# EAGLE design WasteInfoBoard_V_1_2 (EAGLE 7.7.0)
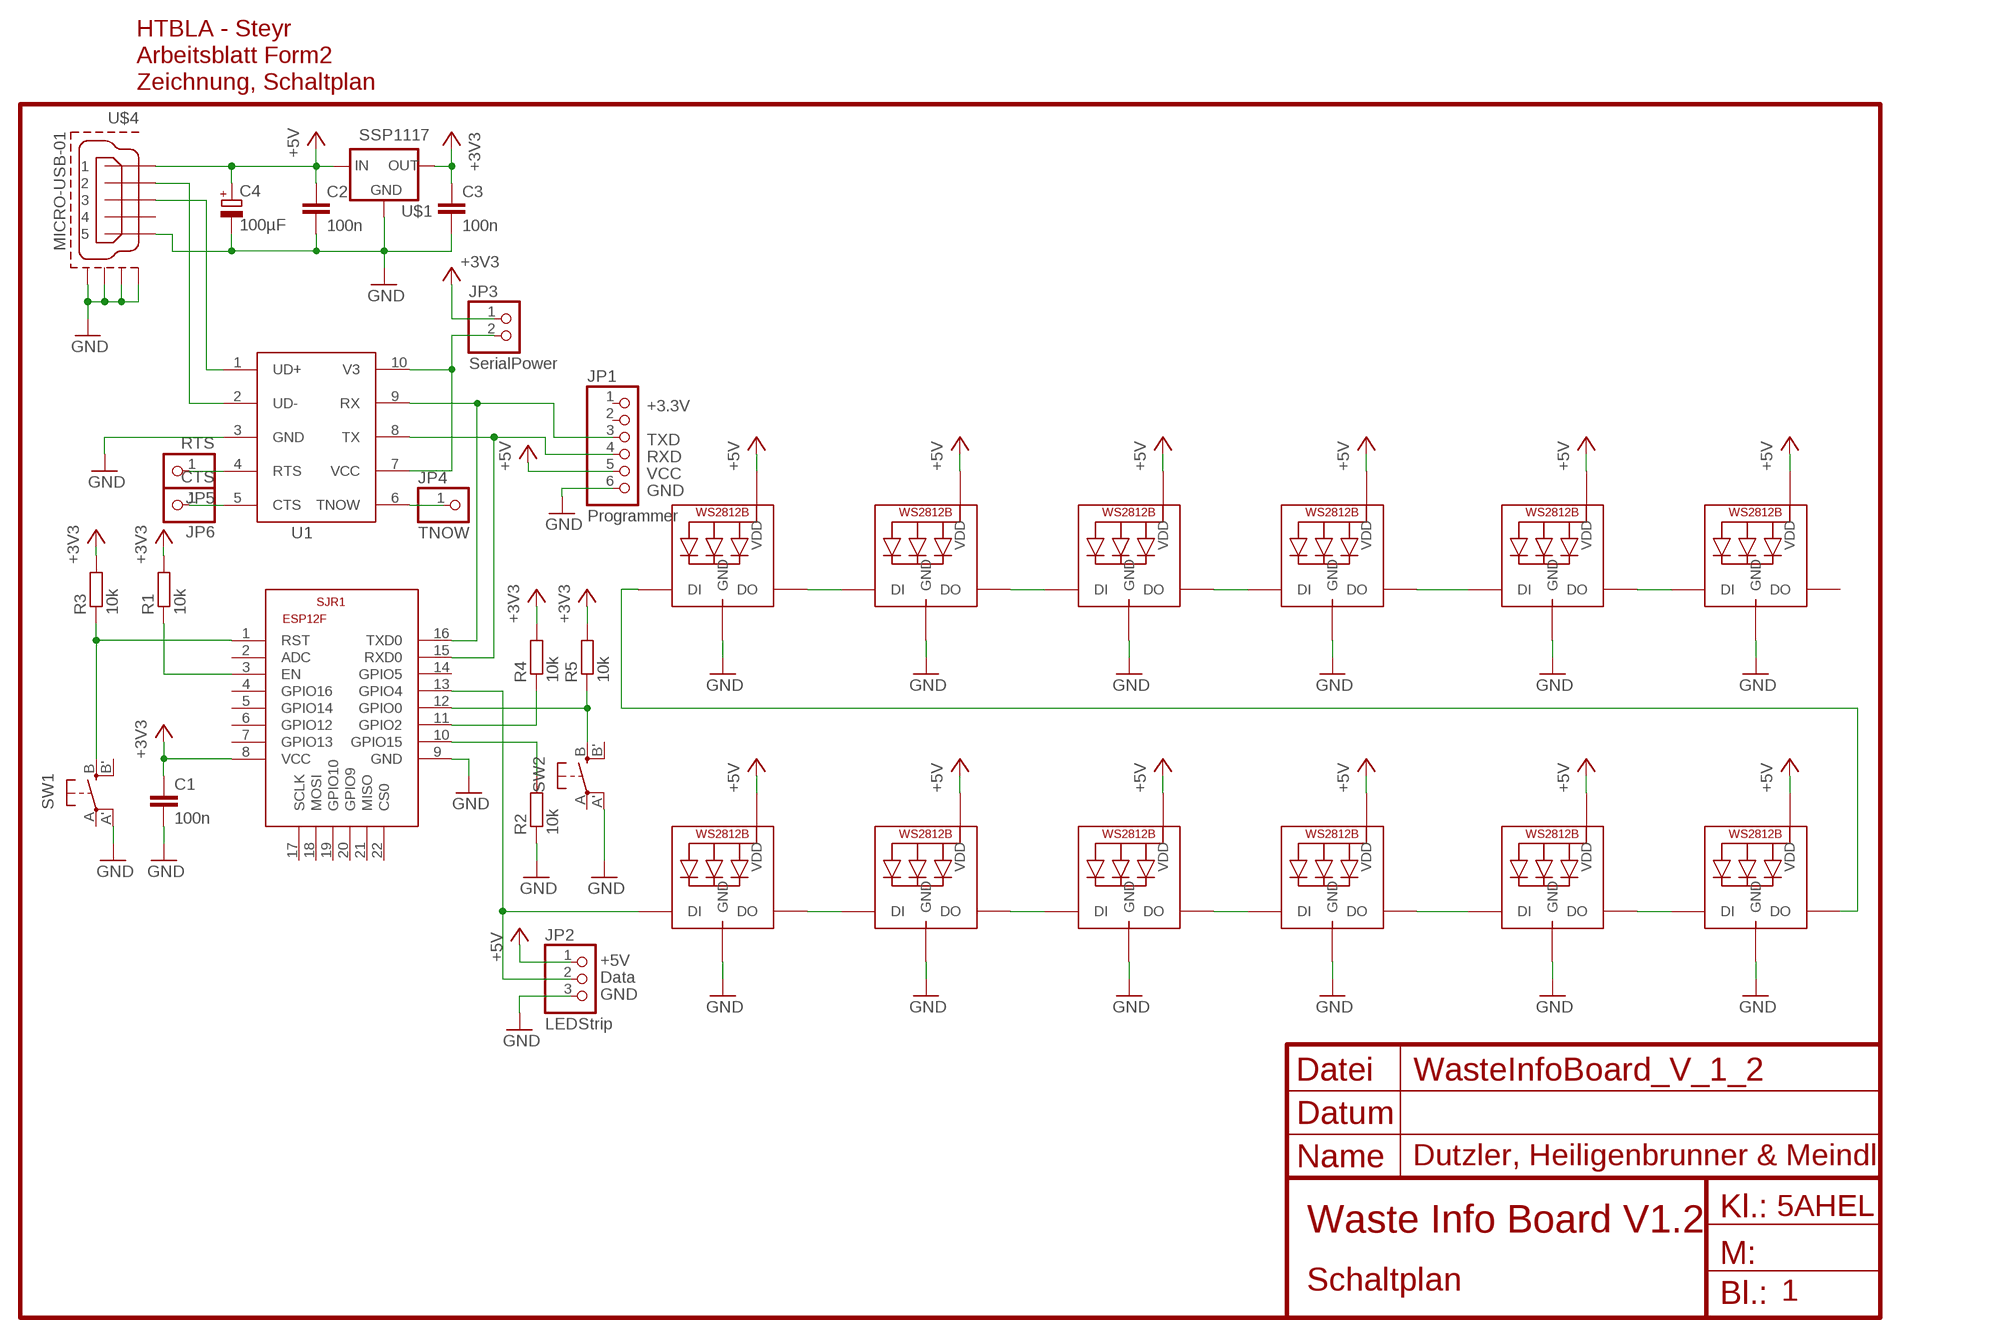
[diagram p0: schematic, sheet 1]

## Parts
C1  100n  C-EUC0805  [C0805]
C2  100n  C-EUC0805  [C0805]
C3  100n  C-EUC0805  [C0805]
C4  100µF  CPOL-EU175TMP-0808  [175TMP-0808]
JP1  Programmer  PINHD-1X6  [1X06]
JP2  LEDStrip  PINHD-1X3  [1X03]
JP3  SerialPower  PINHD-1X2  [1X02]
JP4  TNOW  PINHD-1X1  [1X01]
JP5  RTS  PINHD-1X1  [1X01]
JP6  CTS  PINHD-1X1  [1X01]
LED1  WS2812B5050  [WS2812B]
LED2  WS2812B5050  [WS2812B]
LED3  WS2812B5050  [WS2812B]
LED4  WS2812B5050  [WS2812B]
LED5  WS2812B5050  [WS2812B]
LED6  WS2812B5050  [WS2812B]
LED7  WS2812B5050  [WS2812B]
LED8  WS2812B5050  [WS2812B]
LED9  WS2812B5050  [WS2812B]
LED10  WS2812B5050  [WS2812B]
LED11  WS2812B5050  [WS2812B]
LED12  WS2812B5050  [WS2812B]
R1  10k  R-EUR0805  [R0805]
R2  10k  R-EUR0805  [R0805]
R3  10k  R-EUR0805  [R0805]
R4  10k  R-EUR0805  [R0805]
R5  10k  R-EUR0805  [R0805]
SJR1  ESP8266  ESP8266-12EESP12E  [ESP8266-ESP12E]
SW1  SPST_TACT-EVQQ2  [EVQ-Q2]
SW2  SPST_TACT-EVQQ2  [EVQ-Q2]
U1  CH340ESMD  [MSOP10]
U$1  SSP1117  SSP1117-3.3V  [SOT223]
U$4  MICRO-USB-01  MICRO-USB-RECEPTACLE47589-0001  [47589-0001]

## Nets
+3V3: C1.1 C3.1 JP3.1 R1.2 R3.2 R4.2 R5.2 SJR1.8(VCC) U$1.2(OUT)
+5V: C2.1 C4.+ JP1.5 JP2.1 LED1.1-VDD(VDD) LED2.1-VDD(VDD) LED3.1-VDD(VDD) LED4.1-VDD(VDD) LED5.1-VDD(VDD) LED6.1-VDD(VDD) LED7.1-VDD(VDD) LED8.1-VDD(VDD) LED9.1-VDD(VDD) LED10.1-VDD(VDD) LED11.1-VDD(VDD) LED12.1-VDD(VDD) U$1.3(IN) U$4.1
GND: C1.2 C2.2 C3.2 C4.- JP1.6 JP2.3 LED1.3-GND(GND) LED2.3-GND(GND) LED3.3-GND(GND) LED4.3-GND(GND) LED5.3-GND(GND) LED6.3-GND(GND) LED7.3-GND(GND) LED8.3-GND(GND) LED9.3-GND(GND) LED10.3-GND(GND) LED11.3-GND(GND) LED12.3-GND(GND) R2.1 SJR1.9(GND) SW1.A'(P1) SW2.A'(P1) U1.3(GND) U$1.1(GND) U$4.5 U$4.CASING1(GND1) U$4.CASING2(GND2) U$4.CASING3(GND3) U$4.CASING4(GND4)
N$1: JP2.2 LED1.4-DIN(DI) SJR1.13(GPIO4)
N$2: R2.2 SJR1.10(GPIO15)
N$3: R3.1 SJR1.1(RST) SW1.B(S)
N$4: R1.1 SJR1.3(EN)
N$5: R4.1 SJR1.11(GPIO2)
N$6: R5.1 SJR1.12(GPIO0) SW2.B(S)
N$7: JP1.3 SJR1.16(TXD0) U1.9(RX)
N$8: JP1.4 SJR1.15(RXD0) U1.8(TX)
N$9: LED1.2-DOUT(DO) LED2.4-DIN(DI)
N$10: LED2.2-DOUT(DO) LED3.4-DIN(DI)
N$11: LED3.2-DOUT(DO) LED4.4-DIN(DI)
N$12: LED4.2-DOUT(DO) LED5.4-DIN(DI)
N$13: LED5.2-DOUT(DO) LED6.4-DIN(DI)
N$14: LED7.2-DOUT(DO) LED8.4-DIN(DI)
N$15: LED8.2-DOUT(DO) LED9.4-DIN(DI)
N$16: LED9.2-DOUT(DO) LED10.4-DIN(DI)
N$17: LED10.2-DOUT(DO) LED11.4-DIN(DI)
N$18: LED11.2-DOUT(DO) LED12.4-DIN(DI)
N$19: LED6.2-DOUT(DO) LED7.4-DIN(DI)
N$20: U1.1(UD+) U$4.3
N$21: U1.2(UD-) U$4.2
N$22: JP3.2 U1.7(VCC) U1.10(V3)
N$23: JP5.1 U1.4(RTS)
N$24: JP6.1 U1.5(CTS)
N$25: JP4.1 U1.6(TNOW)
Unconnected: JP1.1 JP1.2 LED12.2-DOUT(DO) SJR1.2(ADC) SJR1.4(GPIO16) SJR1.5(GPIO14) SJR1.6(GPIO12) SJR1.7(GPIO13) SJR1.14(GPIO5) SJR1.17(SCLK) SJR1.18(MOSI) SJR1.19(GPIO10) SJR1.20(GPIO9) SJR1.21(MISO) SJR1.22(CS0) SW1.A(P) SW1.B'(S1) SW2.A(P) SW2.B'(S1) U$4.4

## Notes on the sheet
- +3.3V
- TXD
- RXD
- VCC
- GND
- +5V
- Data
- GND
- Dutzler, Heiligenbrunner & Meindl
- 5AHEL
- Waste Info Board V1.2
- 1

## Library data of the parts
C1-C3 = HTL_RCL:C-EU: CAPACITOR, European symbol
C4 = HTL_RCL:CPOL-EU: POLARIZED CAPACITOR, European symbol
JP1 = HTL_Pinhead:PINHD-1X6: PIN HEADER
JP2 = HTL_Pinhead:PINHD-1X3: PIN HEADER
JP3 = HTL_Pinhead:PINHD-1X2: PIN HEADER
JP4-JP6 = HTL_Pinhead:PINHD-1X1: PIN HEADER
LED1-LED12 = adafruit:WS2812B
R1-R5 = HTL_RCL:R-EU: RESISTOR, European symbol
SJR1 = esp12F:ESP8266-12E: ESP8266-12E Library for Eagle CAD The author not responsible for any damages or errors!. Created by Suhail jr.lt;/author>
SW1 SW2 = adafruit:SPST_TACT: SMT 6mm switch, EVQQ2 series http://www.ladyada.net/library/eagle
U1 = CH340E:CH340E: WCH.CN/CH340E See DataSheet： wch.cn <http://www.wch.cn/downloads/CH340DS1_PDF.html>
U$1 = lm1117:SSP1117-3.3V
U$4 = con-molex-usb:MICRO-USB-RECEPTACLE: MICRO USB RECEPTACLES Micro-USB Receptacles, SMT, Lead-Free from MOLEX <http://www.molex.com/>. (C) 2014 Tomasz Boleslaw CEDRO, cederom@tlen.pl, http://www.tomek.cedro.info. Version 0.1 (2014-01-17): Initial release. Version 0.2 (2014-02-06): Updated 47589-0001 footprint pins/pads/milling. Following devices are included: 1. 47589-0001 Micro-USB AB Receptacle, Bottom Mount, SMT, Lead-Free <http://www.molex.com/molex/products/datasheet.jsp?part=active/0475890001_IO_CONNECTORS.xml> (Technical Drawing <http://www.molex.com/pdm_docs/sd/475890001_sd.pdf>).

## Board
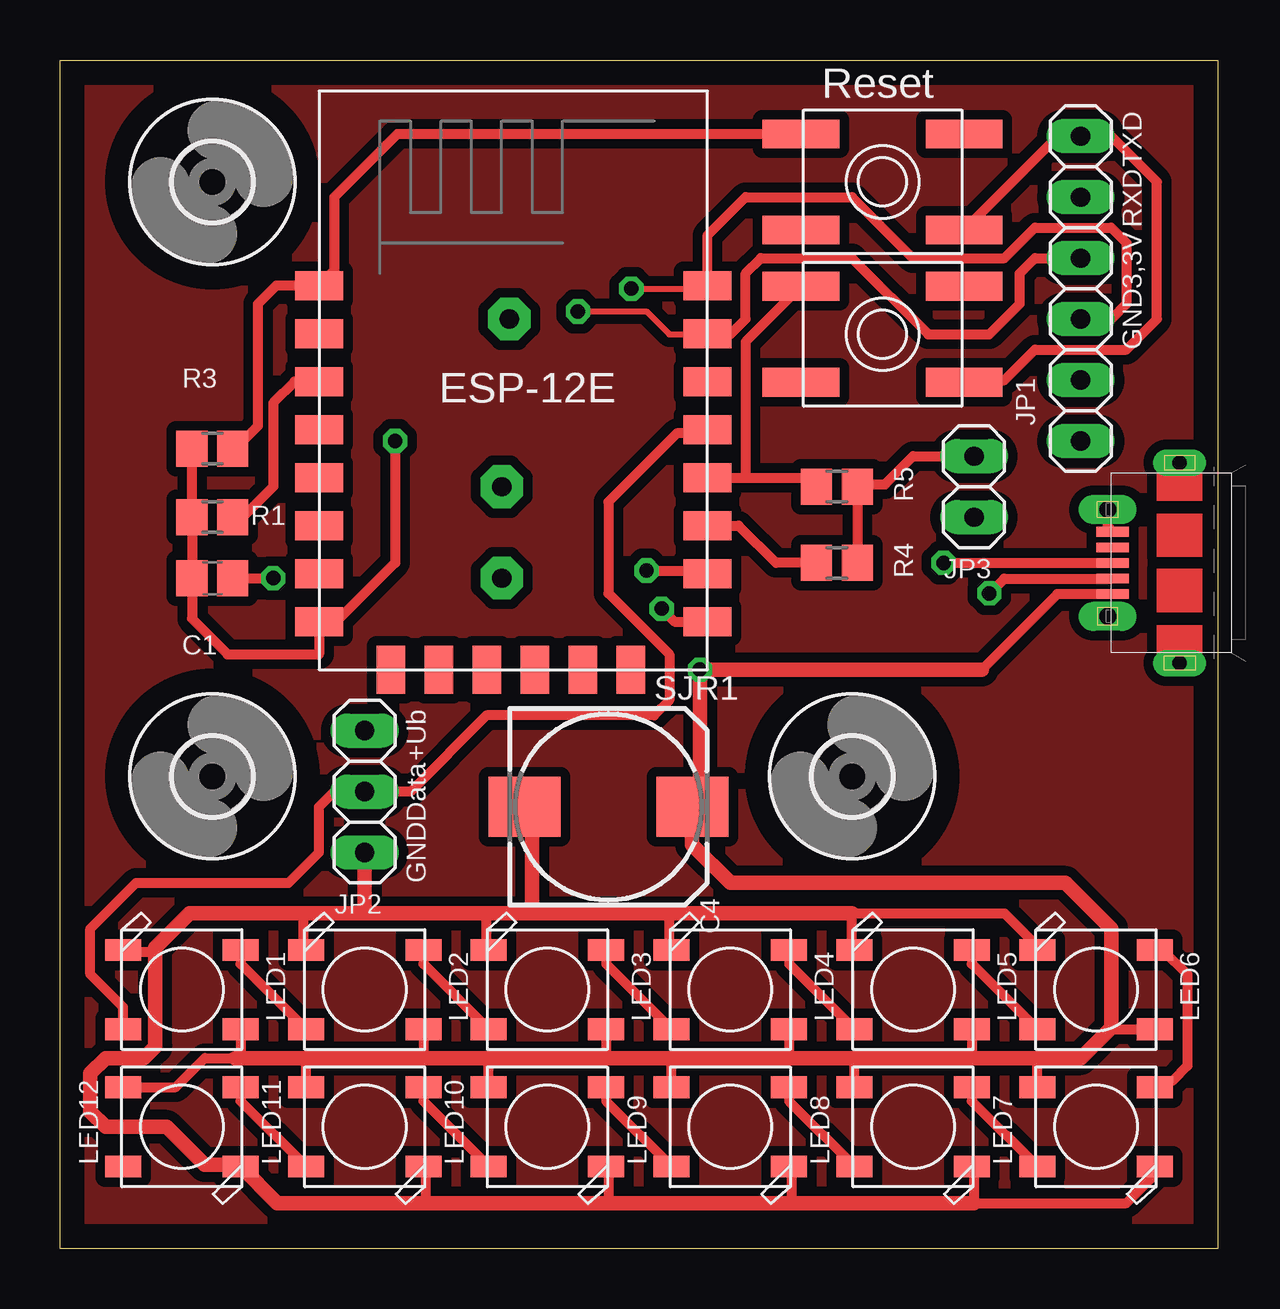
[diagram p1: board, top side]
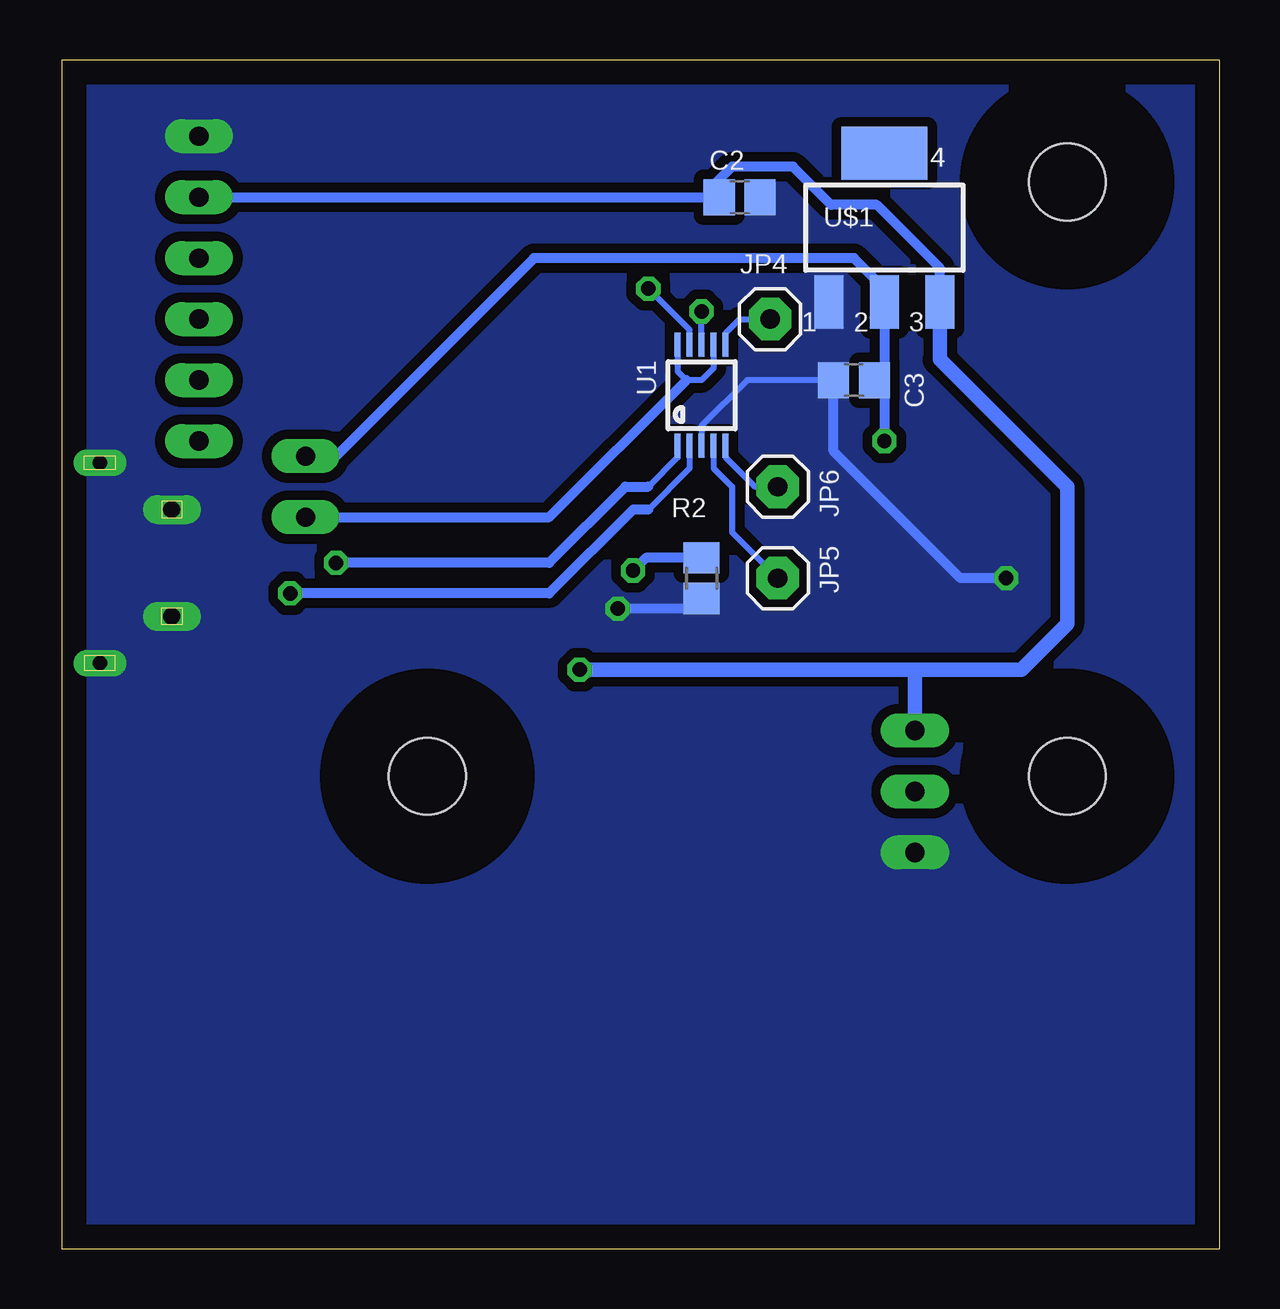
[diagram p2: board, bottom side, seen from below]

Size 48.26 x 49.53 mm. Coordinates in mm from the lower left corner, seen from the top.
Outline: 0,49.53 48.26,49.53 48.26,0 0,0 0,49.53
Copper layers (1*16): Top 0.035mm / dielectric 1.5mm / Bottom 0.035mm
Design rules "default": minimum track width 10mil, minimum drill 24mil, track to track 8mil, track to pad 8mil, pad to pad 8mil, via to via 8mil, smd to smd 8mil, copper to edge 40mil, drill to drill 8mil, minimum pad ring 10mil, minimum via ring 8mil, stop-mask expansion 4mil, vias tented up to drill 0mil, thermal gap 10mil

### Footprints (pad centres in the part's own frame; a part is rotated, then mirrored left to right if it is on the bottom)
C0805 = smd 1.3 x 1.5: 1 -0.85,0; 2 0.85,0
175TMP-0808 = smd 3 x 2.5: + 3.5,0; - -3.5,0
1X06 = drill 0.8 pad 1.422 long: 1 -6.35,0; 2 -3.81,0; 3 -1.27,0; 4 1.27,0; 5 3.81,0; 6 6.35,0
1X03 = drill 0.8 pad 1.422 long: 1 -2.54,0; 2 0,0; 3 2.54,0
1X02 = drill 0.8 pad 1.422 long: 1 -1.27,0; 2 1.27,0
1X01 = drill 0.8 pad 1.778 octagon: 1 0,0
WS2812B = smd 1.5 x 0.9: 1-VDD 2.45,-1.65; 2-DOUT 2.45,1.65; 3-GND -2.45,1.65; 4-DIN -2.45,-1.65
R0805 = smd 1.3 x 1.5: 1 -0.85,0; 2 0.85,0
ESP8266-ESP12E = smd 2 x 1.2: 1 -7.62,5.84; 2 -7.62,3.84; 3 -7.62,1.84; 4 -7.62,-0.16; 5 -7.62,-2.16; 6 -7.62,-4.16; 7 -7.62,-6.16; 8 -7.62,-8.16; 9 8.58,-8.16; 10 8.58,-6.16; 11 8.58,-4.16; 12 8.58,-2.16; 13 8.58,-0.16; 14 8.58,1.84; 15 8.58,3.84; 16 8.58,5.84 | smd 1.2 x 2: 17 -4.62,-10.16; 18 -2.62,-10.16; 19 -0.62,-10.16; 20 1.38,-10.16; 21 3.38,-10.16; 22 5.38,-10.16
EVQ-Q2 = smd 3.2 x 1.2: A -3.4,-2; A' 3.4,-2; B -3.4,2; B' 3.4,2
MSOP10 = smd 1 x 0.25: 1 -2.113,1; 2 -2.113,0.5; 3 -2.113,0; 4 -2.113,-0.5; 5 -2.113,-1; 6 2.113,-1; 7 2.113,-0.5; 8 2.113,0; 9 2.113,0.5; 10 2.113,1
SOT223 = smd 1.219 x 2.235: 1 -2.311,-3.099; 2 0,-3.099; 3 2.311,-3.099 | smd 3.6 x 2.2: 4 0,3.099
3,2 = hole 3.2: 0,0
47589-0001 = smd 1.35 x 0.4: 1 2.8,1.3; 2 2.8,0.65; 3 2.8,0; 4 2.8,-0.65; 5 2.8,-1.3 | drill 0.6 pad 0.95 long: CASING1 0,4.175; CASING2 0,-4.175 | drill 0.7 pad 1.1 long: CASING3 3,2.225; CASING4 3,-2.225

### Placement (x,y rotation side)
C1  6.35,27.94 0 top
C2  20,43.81 0 bottom
C3  15.24,36.2 180 bottom
C4  22.86,18.41 0 top
JP1  42.55,40.01 90 top
JP2  12.7,19.05 270 top
JP3  38.1,31.75 270 top
JP4  18.73,38.73 0 bottom
JP5  18.41,27.94 0 bottom
JP6  18.41,31.75 0 bottom
LED1  5.08,10.79 0 top
LED2  12.7,10.79 0 top
LED3  20.32,10.79 0 top
LED4  27.94,10.79 0 top
LED5  35.56,10.79 0 top
LED6  43.18,10.79 0 top
LED7  43.18,5.08 180 top
LED8  35.56,5.08 180 top
LED9  27.94,5.08 180 top
LED10  20.32,5.08 180 top
LED11  12.7,5.08 180 top
LED12  5.08,5.08 180 top
R1  6.35,30.48 180 top
R2  21.59,27.94 90 bottom
R3  6.35,33.34 180 top
R4  32.38,28.57 0 top
R5  32.38,31.75 0 top
SJR1  18.41,34.29 0 top
SW1  34.29,44.45 0 top
SW2  34.29,38.1 0 top
U1  21.59,35.56 90 bottom
U$1  13.97,42.55 0 bottom
U$2  [3,2]  6.35,44.45 0 top
U$3  [3,2]  6.35,19.68 0 top
U$4  46.67,28.57 180 top
U$5  [3,2]  33.02,19.68 0 top

### Tracks (layer width: path | path; a pad name or v marks a point on that pad's centre or on a via)
+3V3  (via drill 0.6)
  Top 0.406: 10.16,26.04 10.7,26.04 SJR1.8 | v13.97,33.66 13.97,28.57 11.43,26.04 10.89,26.04 SJR1.8 | SJR1.8 10.79,24.77 6.99,24.77 5.5,26.25 C1.1 R1.2 R3.2 | R4.2 R5.2 33.34,31.85 34.39,31.85 35.56,33.02 JP3.1
  Bottom 0.406: 13.97,36.33 v13.97,33.66 | 13.97,36.33 U$1.2 13.97,40.01 15.24,41.27 28.57,41.27 36.83,33.02 JP3.1 | 13.97,36.33 C3.1
+5V  (via drill 0.6)
  Top 0.406: LED12.1-VDD 4.83,6.73 6.03,7.94 7.3,7.94 | LED1.1-VDD 7.53,8.03 7.62,7.94 | LED11.1-VDD 10.25,7.85 10.16,7.94 | LED2.1-VDD 15.15,8.03 15.24,7.94 | LED10.1-VDD 17.87,7.85 17.78,7.94 | LED3.1-VDD 22.77,8.03 22.86,7.94 | LED9.1-VDD 25.49,7.85 25.4,7.94 | LED4.1-VDD 30.39,8.03 30.48,7.94 | LED8.1-VDD 33.11,7.85 33.02,7.94 | LED5.1-VDD 38.01,8.03 38.1,7.94 | LED7.1-VDD 40.73,7.85 40.64,7.94 | 43.81,9.21 43.88,9.14 LED6.1-VDD | U$4.1 41.56,27.27 38.42,24.13
  Top 0.61: 7.3,7.94 7.62,7.94 10.16,7.94 15.24,7.94 17.78,7.94 22.86,7.94 25.4,7.94 30.48,7.94 33.02,7.94 38.1,7.94 40.64,7.94 42.55,7.94 43.81,9.21 43.81,13.34 41.91,15.24 27.94,15.24 26.35,16.83 C4.+ 26.67,19.05 v26.67,24.13 38.42,24.13
  Bottom 0.406: 11.58,39.37 U$1.3 11.66,40.87 14.29,43.5 16.19,43.5 17.78,45.09 20.32,45.09 20.95,44.45 20.95,43.92 C2.1 JP1.5
  Bottom 0.61: 12.7,24.13 8.26,24.13 6.35,26.04 6.35,31.75 11.66,37.06 U$1.3 | 12.7,24.13 v26.67,24.13 | 12.7,24.13 JP2.1
GND  (via drill 0.6)
  Top 0.406: C1.2 v8.89,27.94 | SW1.A' 41.59,46.35 JP1.6 43.81,46.35 45.72,44.45 45.72,38.73 44.45,37.47 40.64,37.47 39.37,36.2 37.78,36.2 SW2.A' | U$4.5 43.67,30.07 U$4.CASING4 | v25.08,26.67 25.62,26.13 SJR1.9 | LED1.3-GND 2.69,12.38 3.81,12.38 3.97,12.54 | LED6.3-GND 40.73,12.61 39.37,13.97 33.02,13.97 33.02,12.54 LED5.3-GND | LED4.3-GND 25.4,12.54 25.4,13.97 | LED3.3-GND 17.78,12.54 17.78,13.97 | LED2.3-GND 10.16,12.54 10.16,13.97 | C4.- 19.68,18.09 | LED12.3-GND 7.47,3.49 | LED7.3-GND 45.63,3.08 44.45,1.91 38.1,1.91 38.1,3.34 LED8.3-GND | LED9.3-GND 30.48,3.34 30.48,1.91 | LED10.3-GND 22.86,3.34 22.86,1.91 | LED11.3-GND 15.24,3.34 15.24,1.91
  Top 0.61: 12.7,13.97 10.16,13.97 5.4,13.97 3.97,12.54 3.97,8.41 3.49,7.94 1.91,7.94 1.27,7.3 1.27,5.71 1.91,5.08 4.45,5.08 6.03,3.49 7.47,3.49 | 12.7,13.97 17.78,13.97 19.68,13.97 | 19.68,13.97 25.4,13.97 33.02,13.97 | JP2.3 12.7,13.97 | 19.68,18.09 19.68,13.97 | LED12.3-GND 9.05,1.91 15.24,1.91 22.86,1.91 30.48,1.91 38.1,1.91
  Bottom 0.254: C3.2 19.68,36.2 21.59,34.29 U1.3
  Bottom 0.406: v8.89,27.94 10.79,27.94 16.09,33.23 C3.2 | R2.1 22.01,26.67 v25.08,26.67
  pour Bottom (isolate 0.406, no thermals): 0,49.53 0,0 48.26,0 48.26,49.53
N$1
  Top 0.406: LED1.4-DIN 2.63,10.07 1.27,11.43 1.27,13.34 3.17,15.24 9.53,15.24 10.79,16.51 10.79,18.41 11.43,19.05 JP2.2 14.61,19.05 17.78,22.23 24.77,22.23 25.4,22.86 25.4,24.77 22.86,27.3 22.86,31.11 25.72,33.97 26.84,33.97 SJR1.13
N$2  (via drill 0.6)
  Top 0.406: v24.45,28.26 26.87,28.26 SJR1.10
  Bottom 0.406: R2.2 23.91,28.79 v24.45,28.26
N$3
  Top 0.406: SW1.B 14.06,46.45 11.43,43.81 11.43,40.77 SJR1.1 9.02,40.13 8.26,39.37 8.26,34.29 7.62,33.66 R3.1
N$4
  Top 0.406: SJR1.3 9.78,36.13 8.89,35.24 8.89,31.75 7.62,30.48 R1.1
N$5
  Top 0.406: SJR1.11 28.29,30.13 29.84,28.57 R4.1
N$6
  Top 0.406: SJR1.12 28.57,32.13 | 28.57,32.13 31.16,32.13 R5.1 | SW2.B 28.57,37.78 28.57,32.13
N$7  (via drill 0.6)
  Top 0.254: v23.81,40.01 26.36,40.01 27,40.64
  Top 0.406: SJR1.16 27,40.64 27,42.23 28.57,43.81 33.02,43.81 35.56,41.27 39.37,41.27 40.64,42.55 43.81,42.55 44.45,41.91 44.45,39.37 43.81,38.73 JP1.3
  Bottom 0.254: U1.9 22.09,38.28 v23.81,40.01
N$8  (via drill 0.6)
  Top 0.254: v21.59,39.05 24.45,39.05 25.4,38.1 26.96,38.1 SJR1.15
  Top 0.406: SJR1.15 27.02,38.1 27.94,38.1 28.57,38.73 28.57,40.64 29.21,41.27 33.02,41.27 36.2,38.1 38.73,38.1 40.01,39.37 40.01,40.64 40.64,41.27 JP1.4
  Bottom 0.254: U1.8 v21.59,39.05
N$9
  Top 0.406: LED1.2-DOUT 7.53,11.87 LED2.4-DIN
N$10
  Top 0.406: LED2.2-DOUT 15.15,11.87 LED3.4-DIN
N$11
  Top 0.406: LED3.2-DOUT 22.77,11.87 LED4.4-DIN
N$12
  Top 0.406: LED4.2-DOUT 30.39,11.87 LED5.4-DIN
N$13
  Top 0.406: LED5.2-DOUT 38.01,11.87 LED6.4-DIN
N$14
  Top 0.406: LED8.4-DIN 38.01,6.15 LED7.2-DOUT
N$15
  Top 0.406: LED9.4-DIN 30.39,6.15 LED8.2-DOUT
N$16
  Top 0.406: LED10.4-DIN 22.77,6.15 LED9.2-DOUT
N$17
  Top 0.406: LED11.4-DIN 15.15,6.15 LED10.2-DOUT
N$18
  Top 0.406: LED12.4-DIN 7.53,6.15 LED11.2-DOUT
N$19
  Top 0.406: LED6.2-DOUT 45.98,12.45 46.99,11.43 46.99,7.62 46.35,6.99 45.88,6.99 LED7.4-DIN
N$20  (via drill 0.6)
  Top 0.406: v36.83,28.57 U$4.3
  Bottom 0.254: 23.81,31.75 22.59,32.97 U1.1
  Bottom 0.406: 23.81,31.75 24.77,31.75 27.94,28.57 v36.83,28.57
N$21  (via drill 0.6)
  Top 0.406: v38.73,27.3 39.35,27.93 U$4.2
  Bottom 0.254: U1.2 22.09,32.52 23.81,30.8
  Bottom 0.406: 23.81,30.8 24.45,30.8 27.94,27.3 v38.73,27.3
N$22
  Bottom 0.254: U1.10 22.59,36.56 22.23,36.2 21.59,36.2 21.09,36.7 U1.7
  Bottom 0.406: JP3.2 27.94,30.48 22.23,36.2
N$23
  Bottom 0.254: U1.4 21.09,32.52 20.32,31.75 20.32,29.84 JP5.1
N$24
  Bottom 0.254: U1.5 20.59,32.97 19.37,31.75 JP6.1
N$25
  Bottom 0.254: U1.6 20.59,38.15 20,38.73 JP4.1
VCC
  pour Top (isolate 0.406, no thermals): 0,49.53 48.26,49.53 48.26,0 0,0

### Text on the board
tNames: Reset | TXD | RXD | 3,3V | GND | +Ub | Data | GND
tValues: Flash | USB TTL Power
tDocu: Dutzler, Heiligenbrunner & Meindl / Waste Information Board V1.2